# EAGLE design Honyone-PB86 (EAGLE 9.6.2)
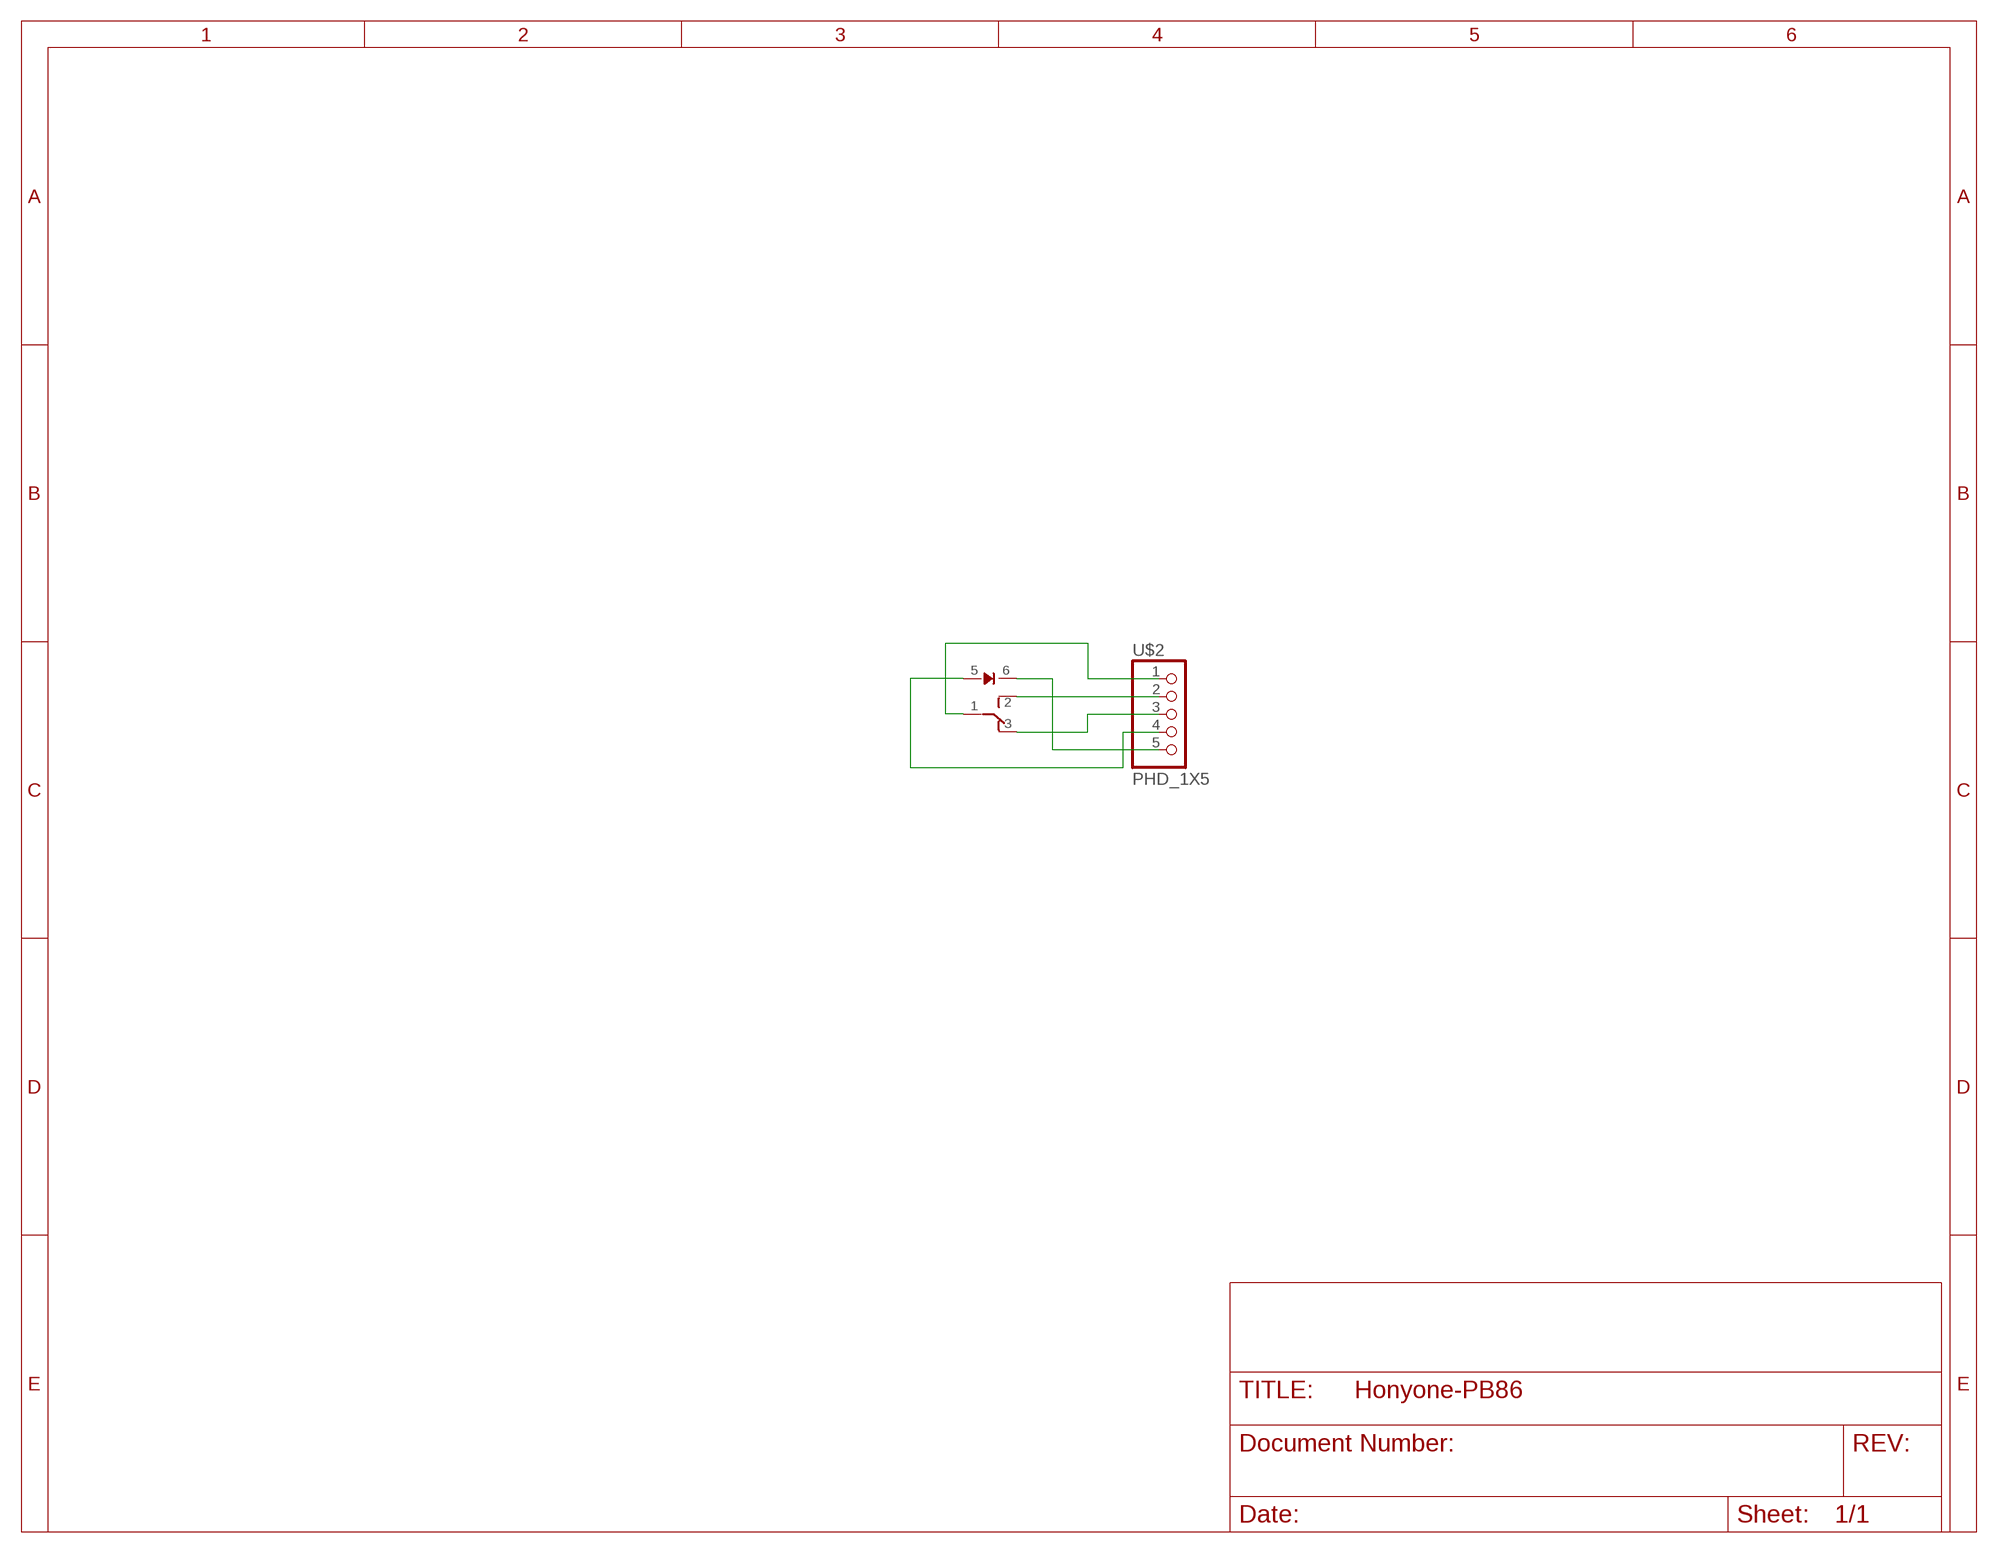
[diagram p0: schematic, sheet 1]

## Parts
U$1  PB86  [PB86]
U$2  PHD_1X5  [PHD_1X5]

## Nets
N$1: U$1.P$2 U$2.2
N$2: U$1.P$1A U$1.P$1B U$2.1
N$3: U$1.P$6 U$2.5
N$4: U$1.P$5 U$2.4
N$5: U$1.P$3 U$2.3

## Library data of the parts
U$1 = Ooo-Switches:PB86
U$2 = Ooo-Connectors:PHD_1X5

## Board
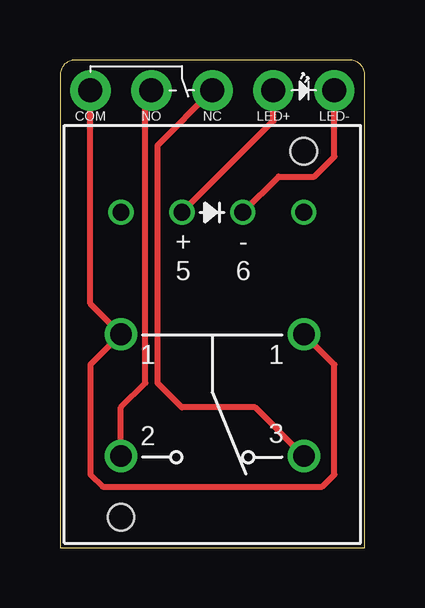
[diagram p1: board, top side]
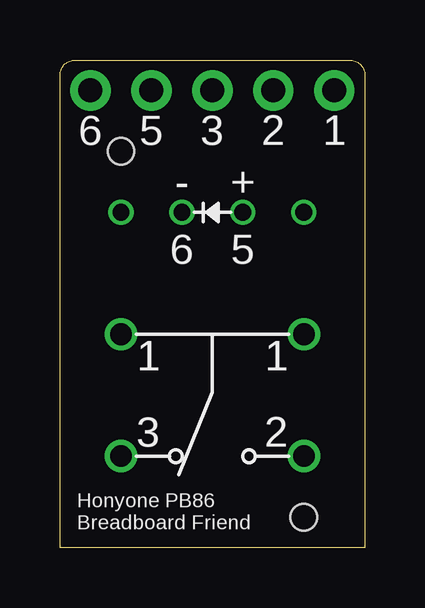
[diagram p2: board, bottom side, seen from below]

Size 12.7 x 20.32 mm. Coordinates in mm from the lower left corner, seen from the top.
Outline: 0,0 12.7,0 12.7,19.68 arc90 12.06,20.32 0.64,20.32 arc90 0,19.68 0,0
Copper layers (1*16): Top 0.035559375mm / dielectric 1.6mm / Bottom 0.035559375mm
Design rules "oshpark-2layer": minimum track width 6mil, minimum drill 10mil, track to track 6mil, track to pad 6mil, pad to pad 6mil, via to via 6mil, smd to smd 6mil, copper to edge 15mil, drill to drill 6mil, minimum pad ring 5mil, minimum via ring 5mil, stop-mask expansion 2.5mil, vias tented up to drill 0mil, thermal gap 10mil

### Footprints (pad centres in the part's own frame; a part is rotated, then mirrored left to right if it is on the bottom)
PB86 = drill 0.9: P$1A 0,7.625; P$1B 7.62,7.625; P$2 0,2.545; P$3 7.62,2.545 | drill 0.7: P$4 0,12.705; P$5 2.54,12.705; P$6 5.08,12.705; P$7 7.62,12.705 | hole 1.1: 0,0; 7.62,15.25
PHD_1X5 = drill 1 pad 1.676: 1 0,0; 2 2.54,0; 3 5.08,0; 4 7.62,0; 5 10.16,0

### Placement (x,y rotation side)
U$1  2.54,1.27 0 top
U$2  1.27,19.05 0 top

### Tracks (layer width: path | path; a pad name or v marks a point on that pad's centre or on a via)
N$1
  Top 0.254: U$1.P$2 2.54,5.84 3.56,6.86 3.56,18.8 U$2.2
N$2
  Top 0.254: U$2.1 1.27,10.16 U$1.P$1A 1.27,7.62 1.27,3.05 1.78,2.54 10.92,2.54 11.43,3.05 11.43,7.62 U$1.P$1B
N$3
  Top 0.254: U$1.P$6 9.11,15.46 10.6,15.46 11.43,16.29 U$2.5
N$4
  Top 0.254: U$1.P$5 8.89,17.79 U$2.4
N$5
  Top 0.254: U$2.3 4.06,16.76 4.06,6.86 5.08,5.84 8.13,5.84 U$1.P$3

### Text on the board
tPlace: COM | NO | NC | LED+ | LED-
bPlace: 1 | 2 | 3 | 5 | 6 | + | - | 5 | 6 | 1 | 1 | 2 | 3 | Honyone PB86 / Breadboard Friend